# Altium schematic sheet EECS430SinglePatch.SchDoc
size B; Author: Nathaniel Kalantar; SheetNumber: 1; SheetTotal: 1
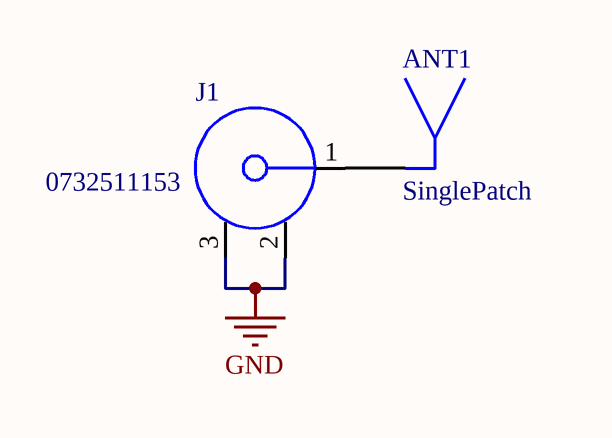
[diagram p0: EECS430SinglePatch.SchDoc]

## Parts
ANT1  SinglePatch  [SinglePatch]
J1  0732511153  [0732511153_2Layer]

## Nets
GND: J1.2 J1.3
NetANT1_1: ANT1.1(ANT) J1.1

## Notes on the sheet
- Size: B

## Library data of the parts
J1 = 0732511153: SMA Connector Jack, Female Socket 50 Ohms Board Edge, End Launch Solder